# Altium project SSTelescope.PrjPcb
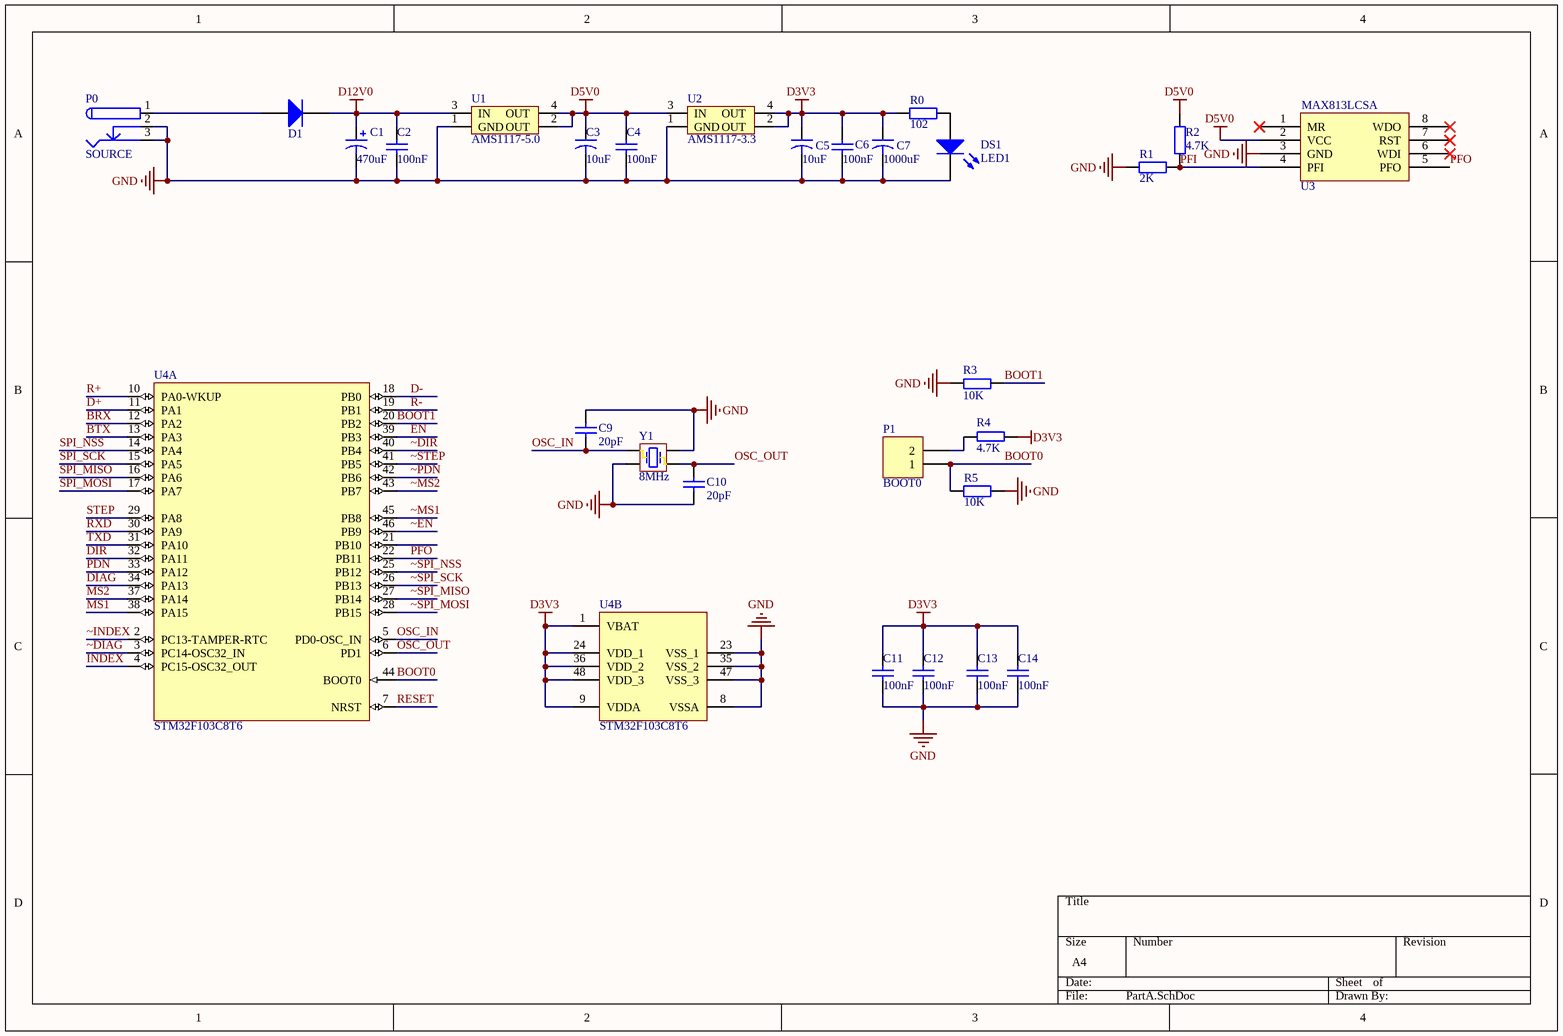
[diagram p0: PartA.SchDoc]
3 sheets, 71 parts. Net scope: global (net labels, ports and power ports of the same name join across sheets).
Board file: SSTelescope.PcbDoc
Sheets:
  PartA.SchDoc
  PartB.SchDoc
  PartC.SchDoc

## Sheet PartA.SchDoc
size A4

### Parts
C1  470uF  [CAP8]
C2  100nF  [0603C]
C3  10uF  [3216]
C4  100nF  [0603C]
C5  10uF  [3216]
C6  100nF  [0603C]
C7  1000uF  [CAP8]
C9  20pF  [0603C]
C10  20pF  [0603C]
C11  100nF  [0603C]
C12  100nF  [0603C]
C13  100nF  [0603C]
C14  100nF  [0603C]
D1  M7  [DO-214AC]  (value not drawn)
DS1  LED1  [0805D]
P0  SOURCE  [DC_5.5MM]
P1  BOOT0  [HDR1X2]
R0  102  [0603R]
R1  2K  [0603R]
R2  4.7K  [0603R]
R3  10K  [0603R]
R4  4.7K  [0603R]
R5  10K  [0603R]
U1  AMS1117-5.0  [SOT223]
U2  AMS1117-3.3  [SOT223]
U3  MAX813LCSA  [SOP-8]
U4  STM32F103C8T6  [LQFP48_N]  (parts A,B of 2)
Y1  8MHz  [X3225]

### Nets
D3V3: C5.1 C6.2 C7.1 C11.2 C12.2 C13.2 C14.2 R0.2 R4.1 U2.2(OUT) U2.4(OUT) U4.1(VBAT) U4.9(VDDA) U4.24(VDD_1) U4.36(VDD_2) U4.48(VDD_3)
D5V0: C3.1 C4.2 R2.2 U1.2(OUT) U1.4(OUT) U2.3(IN) U3.2(VCC)
D12V0: C1.1 C2.2 D1.2(K) U1.3(IN)
GND: C1.2 C2.1 C3.2 C4.1 C5.2 C6.1 C7.2 C9.2 C10.2 C11.1 C12.1 C13.1 C14.1 DS1.2(K) P0.2 P0.3 R1.1 R3.1 R5.2 U1.1(GND) U2.1(GND) U3.3(GND) U4.8(VSSA) U4.23(VSS_1) U4.35(VSS_2) U4.47(VSS_3) Y1.2(NA) Y1.4(NA)
BOOT0: P1.1 R5.1 U4.44(BOOT0)
BOOT1: R3.2 U4.20(PB2)
BRX: U4.12(PA2)
BTX: U4.13(PA3)
D+: U4.11(PA1)
D-: U4.18(PB0)
DIAG: U4.34(PA13)
DIR: U4.32(PA11)
EN: U4.39(PB3)
INDEX: U4.4(PC15-OSC32_OUT)
MS1: U4.38(PA15)
MS2: U4.37(PA14)
OSC_IN: C9.1 U4.5(PD0-OSC_IN) Y1.1(OSC1)
OSC_OUT: C10.1 U4.6(PD1) Y1.3(OSC2)
PDN: U4.33(PA12)
PFI: R1.2 R2.1 U3.4(PFI)
PFO: U3.5(PFO) U4.22(PB11)
R+: U4.10(PA0-WKUP)
R-: U4.19(PB1)
RESET: U4.7(NRST)
RXD: U4.30(PA9)
SPI_MISO: U4.16(PA6)
SPI_MOSI: U4.17(PA7)
SPI_NSS: U4.14(PA4)
SPI_SCK: U4.15(PA5)
STEP: U4.29(PA8)
TXD: U4.31(PA10)
~DIAG: U4.3(PC14-OSC32_IN)
~DIR: U4.40(PB4)
~EN: U4.46(PB9)
~INDEX: U4.2(PC13-TAMPER-RTC)
~MS1: U4.45(PB8)
~MS2: U4.43(PB7)
~PDN: U4.42(PB6)
~SPI_MISO: U4.27(PB14)
~SPI_MOSI: U4.28(PB15)
~SPI_NSS: U4.25(PB12)
~SPI_SCK: U4.26(PB13)
~STEP: U4.41(PB5)
NetD1_1: D1.1(A) P0.1
NetDS1_1: DS1.1(A) R0.1
NetP1_2: P1.2 R4.2

Not connected (* = marked no-connect by the designer): U3 1(MR)* 6(WDI)* 7(RST)* 8(WDO)*; U4 21(PB10)

### Library data of the parts
C1 = C470UF016S: 470UF      16V      CD10X10D5
C2 C4 C6 C9-C14 = Cap: Capacitor; Published: 8-Jun-2000; LatestRevisionDate: 17-Jul-2002; LatestRevisionNote: Re-released for DXP Platform.; PackageReference: RAD-0.3; Publisher: Altium Limited
  C2 C4 C6 C11-C14: Value: 100nF
  C9 C10: Value: 20pF
C3 C5 C7 = CAP2
  C3 C5: vaule: 10uF
  C7: vaule: 1000uF
D1 = Diode: High Conductance Fast Diode; pin to pad: 1>2 2>1; Published: 8-Jun-2000; LatestRevisionDate: 17-Jul-2002; LatestRevisionNote: Re-released for DXP Platform.; DatasheetDocument: 1997; PackageReference: DO-35; Publisher: Altium Limited; Code_JEDEC: DO-204-AH; ComponentLink1Description: Manufacturer Link; ComponentLink1URL: http://www.fairchildsemi.com/; ComponentLink2Description: Datasheet; ComponentLink2URL: http://www.fairchildsemi.com/ds/1N%2F1N4448.pdf
DS1 = LED2: Typical RED, GREEN, YELLOW, AMBER GaAs LED; Published: 8-Jun-2000; LatestRevisionDate: 17-Jul-2002; LatestRevisionNote: Re-released for DXP Platform.; PackageDocument: Feb-2002; PackageReference: 3.2X1.6X1.1; Publisher: Altium Limited
P1 = MHDR1X2: Header, 2-Pin; LatestRevisionDate: 17-Jul-2002; LatestRevisionNote: Re-released for DXP Platform.; Publisher: Altium Limited
R0-R2 R5 = RES: Resistor; Value: 1K; Published: 8-Jun-2000; Revision: July-2002: Re-released for DXP Platform.; Publisher: Altium Limited
R3 R4 = R
U1 U2 = AMS1117
U3 = MAX813L
U4 = STM32F103C8T6: STM32 ARM-based 32-bit MCU Performance Line with 64 kB Flash, 20 kB Internal RAM, -40 to +85癈 Temperature, 48-Pin LQFP, Tray; DatasheetVersion: rev13.0, Apr-2011; PackageVersion: rev13, Apr-2011; PackageReference: LQFP48; PackageDescription: 48-Pin Low-Profile Quad Flat Pack, 7 x 7 mm Body, 0.5 mm Pitch (LQFP48); ComponentLink1Description: Manufacturer URL; ComponentLink1URL: http://www.st.com/; ComponentLink2Description: STM32F103 Datasheet; ComponentLink2URL: http://www.st.com/internet/com/TECHNICAL_RESOURCES/TECHNICAL_LITERATURE/DATASHEET/CD00161566.pdf; ComponentLink3Description: STM32 Family Web Page; ComponentLink3URL: www.st.com/stm32
Y1 = XTAL_1: Crystal Oscillator; Published: 8-Jun-2000; LatestRevisionDate: 17-Jul-2002; LatestRevisionNote: Re-released for DXP Platform.; PackageReference: R38; Publisher: Altium Limited; Value: 8MHz
P0 = SOURCE: LatestRevisionDate: 17-Jul-2002; LatestRevisionNote: Re-released for DXP Platform.; Publisher: Altium Limited

## Sheet PartB.SchDoc
size A4
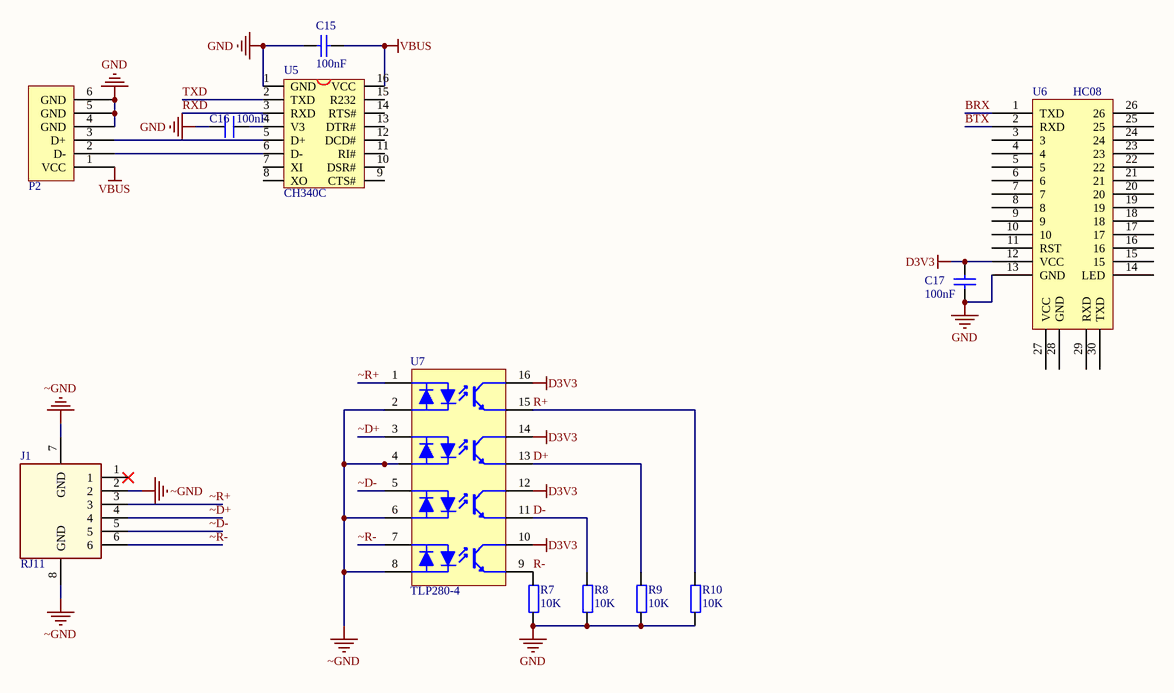
[diagram p1: PartB.SchDoc]

### Parts
C15  100nF  [0603C]
C16  100nF  [0603C]
C17  100nF  [0603C]
J1  RJ11  [RJ11]
P2  USB-B  [USB-B]  (value not drawn)
R7  10K  [0603R]
R8  10K  [0603R]
R9  10K  [0603R]
R10  10K  [0603R]
U5  CH340C  [SO-16]
U6  HC08  [HC-05/06/08V15]
U7  TLP280-4  [SOP16N_L]

### Nets
D3V3: C17.2 U6.12(VCC) U7.10 U7.12 U7.14 U7.16
GND: C15.1 C16.1 C17.1 P2.4(GND) P2.5(GND) P2.6(GND) R7.1 R8.1 R9.1 R10.1 U5.1(GND) U6.13(GND)
VBUS: C15.2 P2.1(VCC) U5.16(VCC)
~GND: J1.2 J1.7(GND) J1.8(GND) U7.2(K) U7.4(C) U7.6 U7.8
BRX: U6.1(TXD)
BTX: U6.2(RXD)
D+: R9.2 U7.13
D-: R8.2 U7.11
R+: R10.2 U7.15
R-: R7.2 U7.9
RXD: U5.3(RXD)
TXD: U5.2(TXD)
~D+: J1.4 U7.3(E)
~D-: J1.5 U7.5
~R+: J1.3 U7.1(A)
~R-: J1.6 U7.7
NetC16_2: C16.2 U5.4(V3)
NetP2_2: P2.2(D-) U5.6(D-)
NetP2_3: P2.3(D+) U5.5(D+)

Not connected (* = marked no-connect by the designer): J1 1* 9 10; U5 7(XI) 8(XO) 9(CTS#) 10(DSR#) 11(RI#) 12(DCD#) 13(DTR#) 14(RTS#) 15(R232); U6 3 4 5 6 7 8 9 10 11(RST) 14(LED) 15 16 17 18 19 20 21 22 23 24 25 26 27(VCC) 28(GND) 29(RXD) 30(TXD)

### Library data of the parts
C15 C17 = Cap: Capacitor; Published: 8-Jun-2000; LatestRevisionDate: 17-Jul-2002; LatestRevisionNote: Re-released for DXP Platform.; PackageReference: RAD-0.3; Publisher: Altium Limited; Value: 100nF
C16 = C
R7-R10 = R
U5 = CH340G: USB2UART
U7 = TLP280-4: 4组光耦; 版权归属: 源创客; BOM名称: 4组光耦; 学习资源: www.ooocke.com

## Sheet PartC.SchDoc
size A4
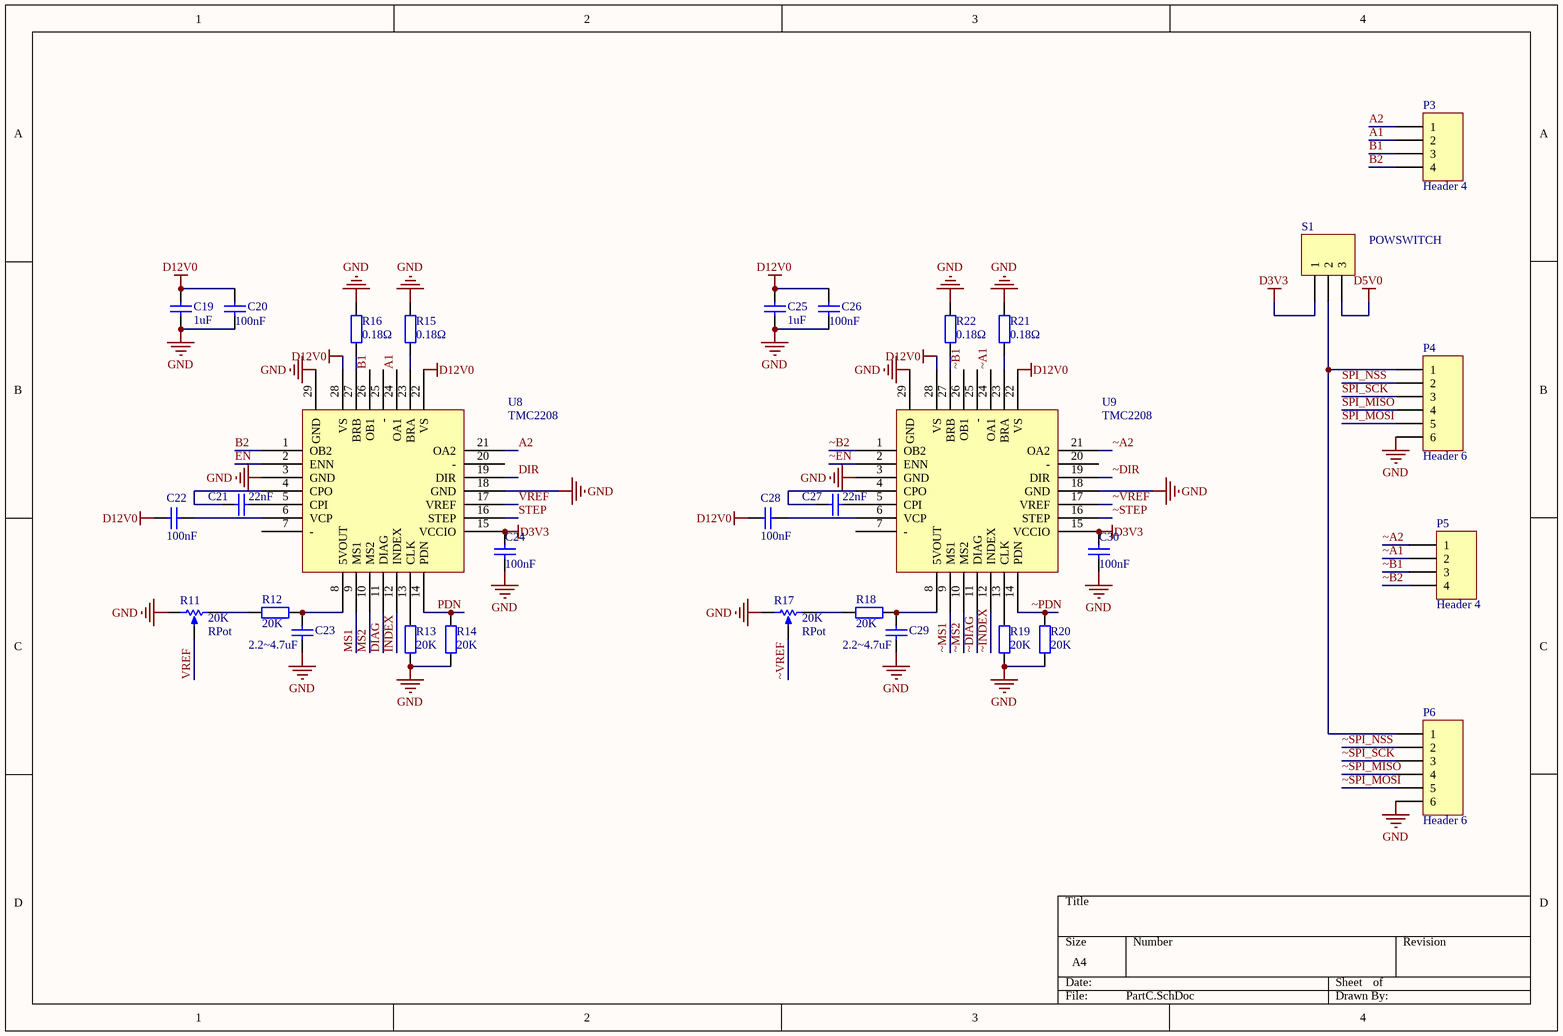
[diagram p2: PartC.SchDoc]

### Parts
C19  1uF  [1206C]
C20  100nF  [0603C]
C21  22nF  [0603C]
C22  100nF  [0603C]
C23  2.2~4.7uF  [0603C]
C24  100nF  [0603C]
C25  1uF  [1206C]
C26  100nF  [0603C]
C27  22nF  [0603C]
C28  100nF  [0603C]
C29  2.2~4.7uF  [0603C]
C30  100nF  [0603C]
P3  Header 4  [XH_4_V]
P4  Header 6  [XH_6_V]
P5  Header 4  [XH_4_V]
P6  Header 6  [XH_6_V]
R11  RPot  value 20K  [VR_SMD]
R12  20K  [0603R]
R13  20K  [0603R]
R14  20K  [0603R]
R15  0.18Ω  [1206R]
R16  0.18Ω  [1206R]
R17  RPot  value 20K  [VR_SMD]
R18  20K  [0603R]
R19  20K  [0603R]
R20  20K  [0603R]
R21  0.18Ω  [1206R]
R22  0.18Ω  [1206R]
S1  POWSWITCH  [HDR1X3]
U8  TMC2208  [QFN28 5x5_M]
U9  TMC2208  [QFN28 5x5_M]

### Nets
D3V3: C24.2 C30.2 S1.1 U8.15(VCCIO) U9.15(VCCIO)
D5V0: S1.3
D12V0: C19.1 C20.2 C22.2 C25.1 C26.2 C28.2 U8.22(VS) U8.28(VS) U9.22(VS) U9.28(VS)
GND: C19.2 C20.1 C23.1 C24.1 C25.2 C26.1 C29.1 C30.1 P4.6 P6.6 R11.1(TOP) R13.1 R14.1 R15.1 R16.1 R17.1(TOP) R19.1 R20.1 R21.1 R22.1 U8.3(GND) U8.18(GND) U8.29(GND) U9.3(GND) U9.18(GND) U9.29(GND)
A1: P3.2 U8.24(OA1)
A2: P3.1 U8.21(OA2)
B1: P3.3 U8.26(OB1)
B2: P3.4 U8.1(OB2)
DIAG: U8.11(DIAG)
DIR: U8.19(DIR)
EN: U8.2(ENN)
INDEX: U8.12(INDEX)
MS1: U8.9(MS1)
MS2: U8.10(MS2)
PDN: R14.2 U8.14(PDN)
SPI_MISO: P4.4
SPI_MOSI: P4.5
SPI_NSS: P4.2
SPI_SCK: P4.3
STEP: U8.16(STEP)
VREF: R11.3(TAP) U8.17(VREF)
~A1: P5.2 U9.24(OA1)
~A2: P5.1 U9.21(OA2)
~B1: P5.3 U9.26(OB1)
~B2: P5.4 U9.1(OB2)
~DIAG: U9.11(DIAG)
~DIR: U9.19(DIR)
~EN: U9.2(ENN)
~INDEX: U9.12(INDEX)
~MS1: U9.9(MS1)
~MS2: U9.10(MS2)
~PDN: R20.2 U9.14(PDN)
~SPI_MISO: P6.4
~SPI_MOSI: P6.5
~SPI_NSS: P6.2
~SPI_SCK: P6.3
~STEP: U9.16(STEP)
~VREF: R17.3(TAP) U9.17(VREF)
NetC21_1: C21.1 U8.5(CPI)
NetC21_2: C21.2 U8.4(CPO)
NetC22_1: C22.1 U8.6(VCP)
NetC23_2: C23.2 R12.1 U8.8(5VOUT)
NetC27_1: C27.1 U9.5(CPI)
NetC27_2: C27.2 U9.4(CPO)
NetC28_1: C28.1 U9.6(VCP)
NetC29_2: C29.2 R18.1 U9.8(5VOUT)
NetP4_1: P4.1 P6.1 S1.2
NetR11_2: R11.2(BOT) R12.2
NetR13_2: R13.2 U8.13(CLK)
NetR15_2: R15.2 U8.23(BRA)
NetR16_2: R16.2 U8.27(BRB)
NetR17_2: R17.2(BOT) R18.2
NetR19_2: R19.2 U9.13(CLK)
NetR21_2: R21.2 U9.23(BRA)
NetR22_2: R22.2 U9.27(BRB)

Not connected (* = marked no-connect by the designer): U8 7(-) 20(-) 25(-); U9 7(-) 20(-) 25(-)

### Library data of the parts
C19-C30 = Cap: Capacitor; Published: 8-Jun-2000; LatestRevisionDate: 17-Jul-2002; LatestRevisionNote: Re-released for DXP Platform.; PackageReference: RAD-0.3; Publisher: Altium Limited
  C19 C25: Value: 1uF
  C20 C22 C24 C26 C28 C30: Value: 100nF
  C21 C27: Value: 22nF
  C23 C29: Value: 2.2~4.7uF
P3 P5 = Header 4: Header, 4-Pin; LatestRevisionDate: 17-Jul-2002; LatestRevisionNote: Re-released for DXP Platform.; Publisher: Altium Limited
P4 P6 = Header 6: Header, 6-Pin; LatestRevisionDate: 17-Jul-2002; LatestRevisionNote: Re-released for DXP Platform.; Publisher: Altium Limited
R11 R17 = RPot: Potentiometer; Sim Note: Enter the Resistance value and the set point into parameter fields.; Set Position: 0.5; Published: 8-Jun-2000; LatestRevisionDate: 17-Jul-2002; LatestRevisionNote: Re-released for DXP Platform.; PackageReference: VR5; Publisher: Altium Limited; PackageDescription: Variable Resistor, Thru-Hole; 3 Leads
R12-R16 R18-R22 = RES: Resistor; Value: 1K; Published: 8-Jun-2000; Revision: July-2002: Re-released for DXP Platform.; Publisher: Altium Limited
S1 = Header 3H: Header, 3-Pin, Right Angle; LatestRevisionDate: 17-Jul-2002; LatestRevisionNote: Re-released for DXP Platform.; Publisher: Altium Limited

## Nets that join several sheets
D3V3: PartA (16 pins), PartB (6 pins), PartC (5 pins)
D5V0: PartA (7 pins), PartC (S1.3)
D12V0: PartA (C1.1 C2.2 D1.2 U1.3), PartC (10 pins)
GND: PartA (28 pins), PartB (12 pins), PartC (26 pins)
BRX: PartA (U4.12), PartB (U6.1)
BTX: PartA (U4.13), PartB (U6.2)
D+: PartA (U4.11), PartB (R9.2 U7.13)
D-: PartA (U4.18), PartB (R8.2 U7.11)
DIAG: PartA (U4.34), PartC (U8.11)
DIR: PartA (U4.32), PartC (U8.19)
EN: PartA (U4.39), PartC (U8.2)
INDEX: PartA (U4.4), PartC (U8.12)
MS1: PartA (U4.38), PartC (U8.9)
MS2: PartA (U4.37), PartC (U8.10)
PDN: PartA (U4.33), PartC (R14.2 U8.14)
R+: PartA (U4.10), PartB (R10.2 U7.15)
R-: PartA (U4.19), PartB (R7.2 U7.9)
RXD: PartA (U4.30), PartB (U5.3)
SPI_MISO: PartA (U4.16), PartC (P4.4)
SPI_MOSI: PartA (U4.17), PartC (P4.5)
SPI_NSS: PartA (U4.14), PartC (P4.2)
SPI_SCK: PartA (U4.15), PartC (P4.3)
STEP: PartA (U4.29), PartC (U8.16)
TXD: PartA (U4.31), PartB (U5.2)
~DIAG: PartA (U4.3), PartC (U9.11)
~DIR: PartA (U4.40), PartC (U9.19)
~EN: PartA (U4.46), PartC (U9.2)
~INDEX: PartA (U4.2), PartC (U9.12)
~MS1: PartA (U4.45), PartC (U9.9)
~MS2: PartA (U4.43), PartC (U9.10)
~PDN: PartA (U4.42), PartC (R20.2 U9.14)
~SPI_MISO: PartA (U4.27), PartC (P6.4)
~SPI_MOSI: PartA (U4.28), PartC (P6.5)
~SPI_NSS: PartA (U4.25), PartC (P6.2)
~SPI_SCK: PartA (U4.26), PartC (P6.3)
~STEP: PartA (U4.41), PartC (U9.16)